# Altium schematic sheet IMUs.SchDoc: Inertial Measurement Units
size A4; CompanyName: SpaceBee Technologies; Organization: Open Space; Address1: Argentina; DocumentNumber: 1; Revision: 0; SheetNumber: 4; SheetTotal: 6; Proyect: Rovertito; Mail: mgmt@spacebeetech.com
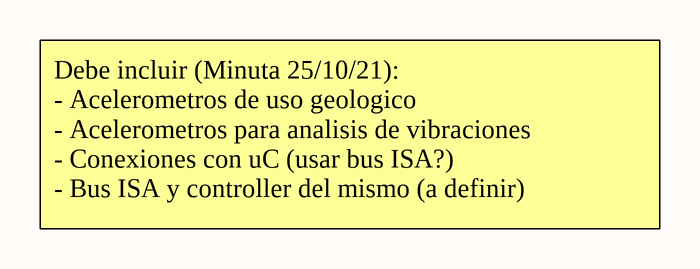
[diagram p0: IMUs.SchDoc]

## Notes on the sheet
- Debe incluir (Minuta 25/10/21):
  - Acelerometros de uso geologico
  - Acelerometros para analisis de vibraciones
  - Conexiones con uC (usar bus ISA?)
  - Bus ISA y controller del mismo (a definir)
- Title
- Board:
- File:
- Authors
- M. Armanasco
- S. Nuñez
- M. Vagalao
- Proyect:
- Date:
- Mail:
- Size:
- Sheet
- A4
- of
- Organization:
- Revision:
- S. Rodriguez
- S. Leguizamon
- J. Alvarez
- and